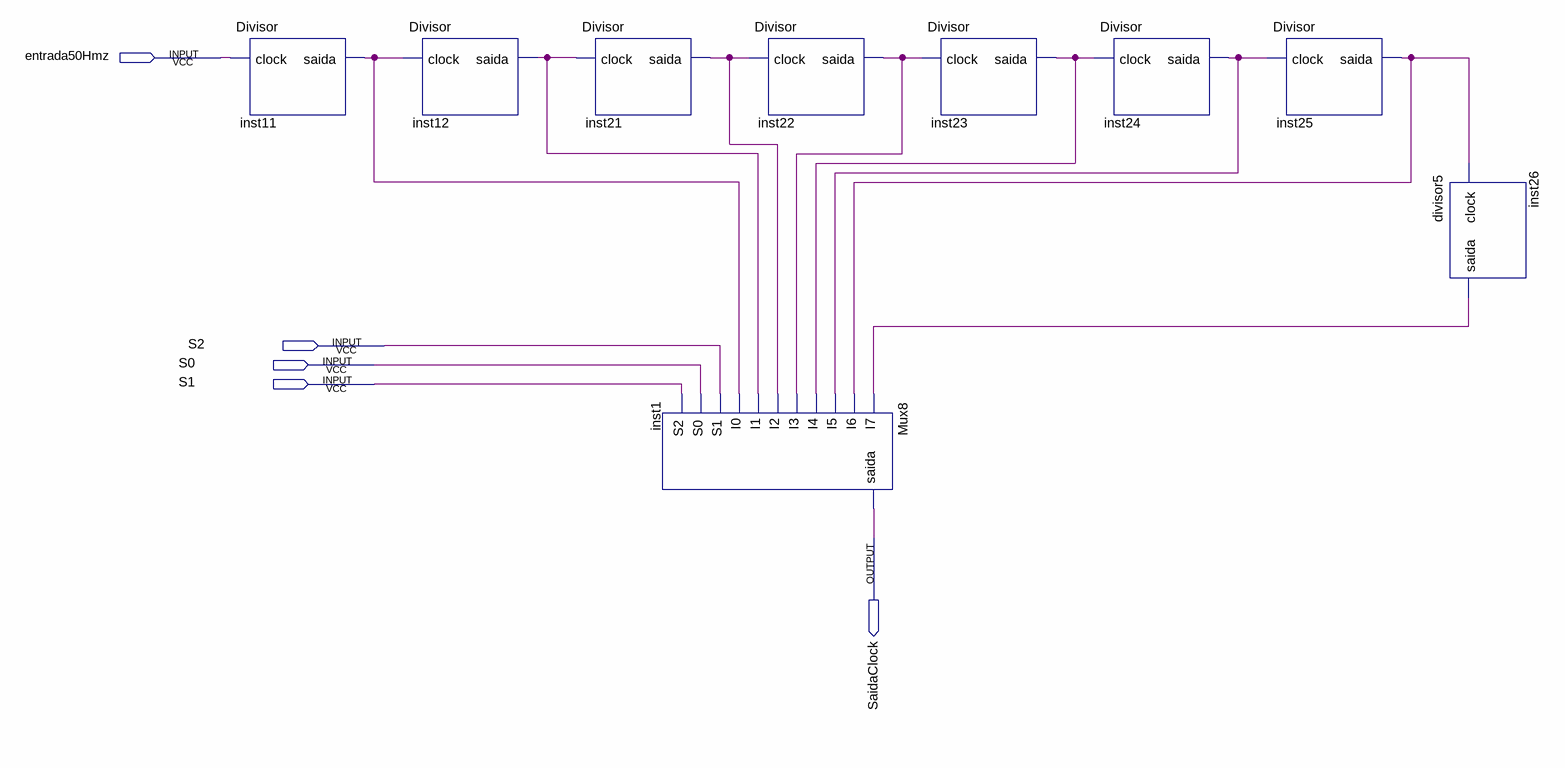
[diagram p0: schematic sheet]
// Quartus schematic Clock50.bdf as structural Verilog: 9 symbols, 5 pins
module Clock50 (
  input  entrada50Hmz,
  input  S2,
  input  S0,
  input  S1,
  output SaidaClock
);

  wire inst11_saida, inst12_saida, inst21_saida, inst22_saida, inst23_saida, inst24_saida, inst25_saida,
       inst26_saida;

  Divisor inst11 (.clock(entrada50Hmz), .saida(inst11_saida));
  Divisor inst12 (.clock(inst11_saida), .saida(inst12_saida));
  Divisor inst21 (.clock(inst12_saida), .saida(inst21_saida));
  Mux8 inst1 (
    .I7(inst26_saida), .I6(inst25_saida), .I5(inst24_saida), .I4(inst23_saida), .I3(inst22_saida),
    .I2(inst21_saida), .I1(inst12_saida), .I0(inst11_saida), .S1(S2), .S0(S0), .S2(S1), .saida(SaidaClock));
  Divisor inst22 (.clock(inst21_saida), .saida(inst22_saida));
  Divisor inst23 (.clock(inst22_saida), .saida(inst23_saida));
  Divisor inst24 (.clock(inst23_saida), .saida(inst24_saida));
  Divisor inst25 (.clock(inst24_saida), .saida(inst25_saida));
  divisor5 inst26 (.clock(inst25_saida), .saida(inst26_saida));
endmodule
